# Altium schematic sheet Power.SchDoc
size A
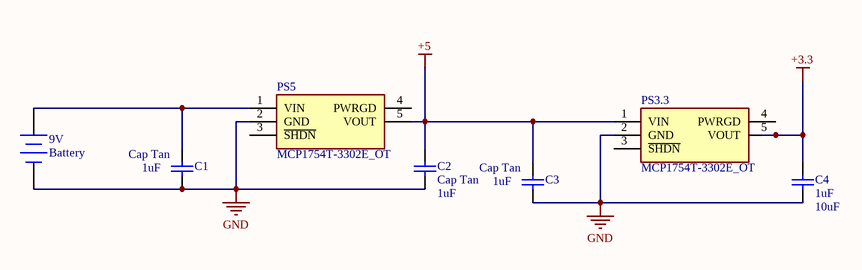
[diagram p0: Power.SchDoc]

## Parts
9V  Battery  [BAT-2]
C1  Cap Tan  value 1uF  [1608[0603]]
C2  Cap Tan  value 1uF  [1608[0603]]
C3  Cap Tan  value 1uF  [1608[0603]]
C4  1uF  value 10uF  [1608[0603]]
PS3.3  MCP1754T-3302E_OT  [SOT95P270X145-5N]
PS5  MCP1754T-3302E_OT  [SOT95P270X145-5N]

## Nets
+3.3: C4.1 PS3.3.5(VOUT)
+5: C2.1 C3.2 PS3.3.1(VIN) PS5.5(VOUT)
GND: 9V.2(-) C1.1 C2.2 C3.1 C4.2 PS3.3.2(GND) PS5.2(GND)
Net9V_1: 9V.1(+) C1.2 PS5.1(VIN)

Not connected (* = marked no-connect by the designer): PS3.3 3(~{SHDN}) 4(PWRGD); PS5 3(~{SHDN}) 4(PWRGD)

## Library data of the parts
9V = Battery: Multicell Battery; Published: 24-Mar-1999; LatestRevisionDate: 17-Jul-2002; LatestRevisionNote: Re-released for DXP Platform.; PackageReference: BAT-2; Publisher: Altium Limited; PackageDescription: Battery; 2 Leads
C1-C4 = Cap Semi: Capacitor (Semiconductor SIM Model); Published: 8-Jun-2000; LatestRevisionDate: 29-May-2009; LatestRevisionNote: IPC-7351 Footprint Added.; PackageReference: C1206; Publisher: Altium Limited; PackageDescription: Chip Capacitor
PS3.3 PS5 = MCP1754T-3302E_OT: Power Supply; Manufacturer_Name: Microchip; Manufacturer_Part_Number: MCP1754T-3302E/OT; Allied_Number: 70451943; Datasheet Link: http://ww1.microchip.com/downloads/en/DeviceDoc/20002276C.pdf; Height: 1.45mm; Mouser Part Number: 579-MCP1754T3302EOT; Mouser Price/Stock: https://www.mouser.com/Search/Refine.aspx?Keyword=579-MCP1754T3302EOT; Allied Price/Stock: https://www.alliedelec.com/microchiptechnologyinc-mcp1754t-3302e-ot/70451943/